# EAGLE design criticality_shield (EAGLE 7.0.0)
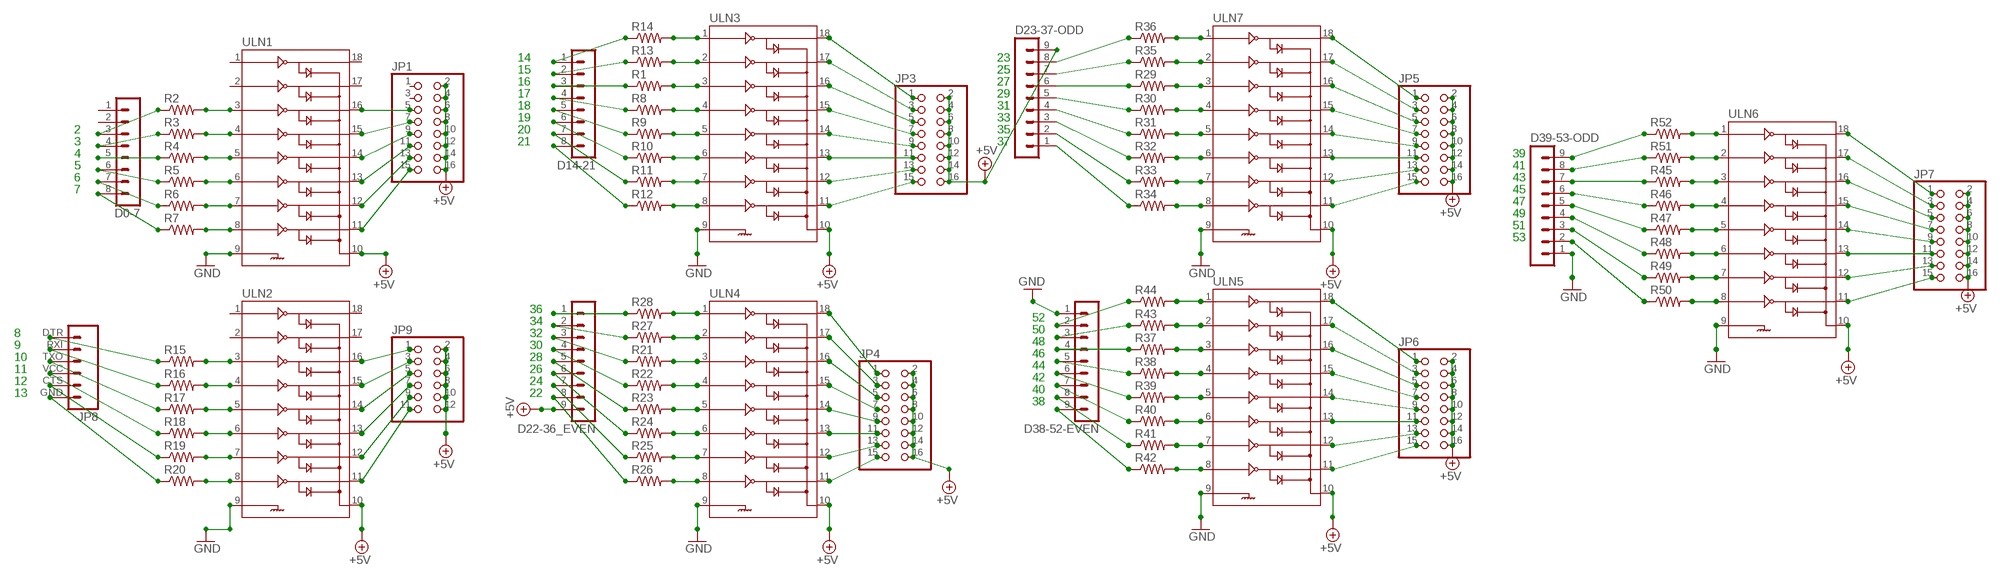
[diagram p0: schematic, sheet 1]

## Parts
D0-7  MA08-1  [MA08-1]
D14-21  MA08-1  [MA08-1]
D22-36_EVEN  MA09-1  [MA09-1]
D23-37-ODD  MA09-1  [MA09-1]
D38-52-EVEN  MA09-1  [MA09-1]
D39-53-ODD  MA09-1  [MA09-1]
JP1  PINHD-2X8  [2X08]
JP3  PINHD-2X8  [2X08]
JP4  PINHD-2X8  [2X08]
JP5  PINHD-2X8  [2X08]
JP6  PINHD-2X8  [2X08]
JP7  PINHD-2X8  [2X08]
JP8  M06SIP  [1X06]
JP9  PINHD-2X6  [2X06]
R1  RESISTOR0603  [0603-RES]
R2  RESISTOR0603  [0603-RES]
R3  RESISTOR0603  [0603-RES]
R4  RESISTOR0603  [0603-RES]
R5  RESISTOR0603  [0603-RES]
R6  RESISTOR0603  [0603-RES]
R7  RESISTOR0603  [0603-RES]
R8  RESISTOR0603  [0603-RES]
R9  RESISTOR0603  [0603-RES]
R10  RESISTOR0603  [0603-RES]
R11  RESISTOR0603  [0603-RES]
R12  RESISTOR0603  [0603-RES]
R13  RESISTOR0603  [0603-RES]
R14  RESISTOR0603  [0603-RES]
R15  RESISTOR0603  [0603-RES]
R16  RESISTOR0603  [0603-RES]
R17  RESISTOR0603  [0603-RES]
R18  RESISTOR0603  [0603-RES]
R19  RESISTOR0603  [0603-RES]
R20  RESISTOR0603  [0603-RES]
R21  RESISTOR0603  [0603-RES]
R22  RESISTOR0603  [0603-RES]
R23  RESISTOR0603  [0603-RES]
R24  RESISTOR0603  [0603-RES]
R25  RESISTOR0603  [0603-RES]
R26  RESISTOR0603  [0603-RES]
R27  RESISTOR0603  [0603-RES]
R28  RESISTOR0603  [0603-RES]
R29  RESISTOR0603  [0603-RES]
R30  RESISTOR0603  [0603-RES]
R31  RESISTOR0603  [0603-RES]
R32  RESISTOR0603  [0603-RES]
R33  RESISTOR0603  [0603-RES]
R34  RESISTOR0603  [0603-RES]
R35  RESISTOR0603  [0603-RES]
R36  RESISTOR0603  [0603-RES]
R37  RESISTOR0603  [0603-RES]
R38  RESISTOR0603  [0603-RES]
R39  RESISTOR0603  [0603-RES]
R40  RESISTOR0603  [0603-RES]
R41  RESISTOR0603  [0603-RES]
R42  RESISTOR0603  [0603-RES]
R43  RESISTOR0603  [0603-RES]
R44  RESISTOR0603  [0603-RES]
R45  RESISTOR0603  [0603-RES]
R46  RESISTOR0603  [0603-RES]
R47  RESISTOR0603  [0603-RES]
R48  RESISTOR0603  [0603-RES]
R49  RESISTOR0603  [0603-RES]
R50  RESISTOR0603  [0603-RES]
R51  RESISTOR0603  [0603-RES]
R52  RESISTOR0603  [0603-RES]
ULN1  ULN2803SOICW  [SO18L]
ULN2  ULN2803SOICW  [SO18L]
ULN3  ULN2803SOICW  [SO18L]
ULN4  ULN2803SOICW  [SO18L]
ULN5  ULN2803SOICW  [SO18L]
ULN6  ULN2803SOICW  [SO18L]
ULN7  ULN2803SOICW  [SO18L]

## Nets
+5V: D22-36_EVEN.9 D23-37-ODD.9 JP1.2 JP1.4 JP1.6 JP1.8 JP1.10 JP1.12 JP1.14 JP1.16 JP3.2 JP3.4 JP3.6 JP3.8 JP3.10 JP3.12 JP3.14 JP3.16 JP4.2 JP4.4 JP4.6 JP4.8 JP4.10 JP4.12 JP4.14 JP4.16 JP5.2 JP5.4 JP5.6 JP5.8 JP5.10 JP5.12 JP5.14 JP5.16 JP6.2 JP6.4 JP6.6 JP6.8 JP6.10 JP6.12 JP6.14 JP6.16 JP7.2 JP7.4 JP7.6 JP7.8 JP7.10 JP7.12 JP7.14 JP7.16 JP9.2 JP9.4 JP9.6 JP9.8 JP9.10 JP9.12 ULN1.10 ULN2.10 ULN3.10 ULN4.10 ULN5.10 ULN6.10 ULN7.10
GND: D38-52-EVEN.1 D39-53-ODD.1 ULN1.9 ULN2.9 ULN3.9 ULN4.9 ULN5.9 ULN6.9 ULN7.9
N$1: D0-7.3 R2.1
N$2: D0-7.4 R3.1
N$3: D0-7.5 R4.1
N$4: D0-7.6 R5.1
N$5: JP8.DTR R15.1
N$6: JP8.RXI R16.1
N$7: D0-7.7 R6.1
N$8: D0-7.8 R7.1
N$9: R13.2 ULN3.2
N$10: R14.2 ULN3.1
N$11: JP1.5 ULN1.16
N$12: JP1.7 ULN1.15
N$13: JP8.TXO R17.1
N$14: JP8.VCC R18.1
N$15: JP8.CTS R19.1
N$16: JP8.GND R20.1
N$18: JP9.1 ULN2.16
N$19: JP9.3 ULN2.15
N$20: D14-21.1 R14.1
N$21: D14-21.2 R13.1
N$22: D14-21.3 R1.1
N$23: D14-21.4 R8.1
N$24: JP9.5 ULN2.14
N$25: JP9.7 ULN2.13
N$26: JP9.9 ULN2.12
N$27: D14-21.5 R9.1
N$28: D14-21.6 R10.1
N$29: JP1.13 ULN1.12
N$30: JP1.15 ULN1.11
N$31: D14-21.7 R11.1
N$32: D14-21.8 R12.1
N$33: JP3.1 ULN3.18
N$34: JP3.3 ULN3.17
N$35: R26.2 ULN4.8
N$36: R25.2 ULN4.7
N$37: R12.2 ULN3.8
N$38: R11.2 ULN3.7
N$39: R24.2 ULN4.6
N$40: R23.2 ULN4.5
N$41: R22.2 ULN4.4
N$42: R21.2 ULN4.3
N$43: R10.2 ULN3.6
N$44: R9.2 ULN3.5
N$45: R27.2 ULN4.2
N$46: R28.2 ULN4.1
N$47: D22-36_EVEN.1 R28.1
N$48: D22-36_EVEN.2 R27.1
N$49: D22-36_EVEN.3 R21.1
N$50: D22-36_EVEN.4 R22.1
N$51: R34.2 ULN7.8
N$52: R33.2 ULN7.7
N$53: D22-36_EVEN.5 R23.1
N$54: D22-36_EVEN.6 R24.1
N$55: D22-36_EVEN.7 R25.1
N$56: D22-36_EVEN.8 R26.1
N$57: R32.2 ULN7.6
N$58: R31.2 ULN7.5
N$59: R30.2 ULN7.4
N$60: R29.2 ULN7.3
N$61: R35.2 ULN7.2
N$62: R36.2 ULN7.1
N$63: D23-37-ODD.8 R36.1
N$64: D23-37-ODD.7 R35.1
N$65: D23-37-ODD.6 R29.1
N$66: JP1.9 ULN1.14
N$67: JP1.11 ULN1.13
N$68: D23-37-ODD.5 R30.1
N$69: D23-37-ODD.4 R31.1
N$70: R42.2 ULN5.8
N$71: R41.2 ULN5.7
N$72: R40.2 ULN5.6
N$73: R39.2 ULN5.5
N$74: R38.2 ULN5.4
N$75: R37.2 ULN5.3
N$76: R43.2 ULN5.2
N$77: R44.2 ULN5.1
N$78: D38-52-EVEN.2 R44.1
N$79: D38-52-EVEN.3 R43.1
N$80: D38-52-EVEN.4 R37.1
N$81: D38-52-EVEN.5 R38.1
N$82: D23-37-ODD.3 R32.1
N$83: D23-37-ODD.2 R33.1
N$84: D23-37-ODD.1 R34.1
N$85: D38-52-EVEN.6 R39.1
N$86: D38-52-EVEN.7 R40.1
N$87: D38-52-EVEN.8 R41.1
N$88: D38-52-EVEN.9 R42.1
N$89: R50.2 ULN6.8
N$90: R49.2 ULN6.7
N$91: R48.2 ULN6.6
N$92: R47.2 ULN6.5
N$93: R46.2 ULN6.4
N$94: R45.2 ULN6.3
N$95: R51.2 ULN6.2
N$96: R52.2 ULN6.1
N$97: D39-53-ODD.9 R52.1
N$98: D39-53-ODD.8 R51.1
N$99: D39-53-ODD.7 R45.1
N$100: D39-53-ODD.6 R46.1
N$101: D39-53-ODD.5 R47.1
N$102: D39-53-ODD.4 R48.1
N$103: D39-53-ODD.3 R49.1
N$104: D39-53-ODD.2 R50.1
N$105: R7.2 ULN1.8
N$106: R6.2 ULN1.7
N$107: R5.2 ULN1.6
N$108: R4.2 ULN1.5
N$109: R3.2 ULN1.4
N$110: R2.2 ULN1.3
N$111: R8.2 ULN3.4
N$112: R1.2 ULN3.3
N$113: JP4.1 ULN4.18
N$114: JP4.3 ULN4.17
N$115: JP4.5 ULN4.16
N$116: JP4.7 ULN4.15
N$117: JP4.9 ULN4.14
N$118: JP4.11 ULN4.13
N$119: JP4.13 ULN4.12
N$120: JP4.15 ULN4.11
N$121: JP9.11 ULN2.11
N$122: JP5.1 ULN7.18
N$123: JP5.3 ULN7.17
N$124: JP5.5 ULN7.16
N$125: JP5.7 ULN7.15
N$126: JP5.9 ULN7.14
N$127: JP3.5 ULN3.16
N$128: JP3.7 ULN3.15
N$129: JP3.9 ULN3.14
N$130: JP3.11 ULN3.13
N$131: JP3.13 ULN3.12
N$132: JP3.15 ULN3.11
N$133: R20.2 ULN2.8
N$134: R19.2 ULN2.7
N$135: JP7.1 ULN6.18
N$136: JP7.3 ULN6.17
N$137: JP7.5 ULN6.16
N$138: JP7.7 ULN6.15
N$139: JP7.9 ULN6.14
N$140: JP7.11 ULN6.13
N$141: JP7.13 ULN6.12
N$142: JP7.15 ULN6.11
N$143: JP5.11 ULN7.13
N$144: JP5.13 ULN7.12
N$145: JP5.15 ULN7.11
N$146: JP6.1 ULN5.18
N$147: JP6.3 ULN5.17
N$148: JP6.5 ULN5.16
N$149: JP6.7 ULN5.15
N$150: JP6.9 ULN5.14
N$159: R18.2 ULN2.6
N$160: R17.2 ULN2.5
N$161: R16.2 ULN2.4
N$162: R15.2 ULN2.3
N$163: JP6.11 ULN5.13
N$164: JP6.13 ULN5.12
N$165: JP6.15 ULN5.11
Unconnected: D0-7.1 D0-7.2 JP1.1 JP1.3 ULN1.1 ULN1.2 ULN1.17 ULN1.18 ULN2.1 ULN2.2 ULN2.17 ULN2.18

## Notes on the sheet
- 14 | 23
- 15 | 25
- 16 | 27
- 17 | 29
- 18 | 31
- 19 | 33
- 2 | 20 | 35
- 3 | 21 | 37
- 4 | 39
- 5 | 41
- 6 | 43
- 7 | 45
- 47
- 49
- 51
- 53
- 36 | 52
- 34 | 50
- 8 | 32 | 48
- 9 | 30 | 46
- 10 | 28 | 44
- 11 | 26 | 42
- 12 | 24 | 40
- 13 | 22 | 38

## Library data of the parts
D0-7 D14-21 = con-lstb:MA08-1: PIN HEADER; OC_FARNELL: unknown; OC_NEWARK: unknown
D22-36_EVEN D23-37-ODD D38-52-EVEN D39-53-ODD = con-lstb:MA09-1: PIN HEADER; OC_FARNELL: unknown; OC_NEWARK: unknown
JP1 JP3-JP7 = pinhead:PINHD-2X8: PIN HEADER
JP8 = SparkFun-Connectors:M06: Header 6 Standard 6-pin 0.1" header. Use with straight break away headers (SKU : PRT-00116), right angle break away headers (PRT-00553), swiss pins (PRT-00743), machine pins (PRT-00117), and female headers (PRT-00115). Molex polarized connector foot print use with SKU : PRT-08094 with associated crimp pins and housings. NOTES ON THE VARIANTS LOCK and LOCK_LONGPADS... This footprint was designed to help hold the alignment of a through-hole component (i.e. 6-pin header) while soldering it into place. You may notice that each hole has been shifted either up or down by 0.005 of an inch from it's more standard position (which is a perfectly straight line). This slight alteration caused the pins (the squares in the middle) to touch the edges of the holes. Because they are alternating, it causes a "brace" to hold the component in place. 0.005 has proven to be the perfect amount of "off-center" position when using our standard breakaway headers. Although looks a little odd when you look at the bare footprint, once you have a header in there, the alteration is very hard to notice. Also,if you push a header all the way into place, it is covered up entirely on the bottom side. This idea of altering the position of holes to aid alignment will be further integrated into the Sparkfun Library for other footprints. It can help hold any component with 3 or more connection pins.
JP9 = pinhead:PINHD-2X6: PIN HEADER
R1-R52 = SparkFun-Resistors:RESISTOR: Resistor Basic schematic elements and footprints for 0603, 1206, and PTH resistors.
ULN1-ULN7 = SparkFun-PowerIC:ULN2803: Darlington Driver ULN2803 Darlington array. 500mA max per channel, 8-channel package. Spark Fun Electronics SKU : COM-00312

## Board
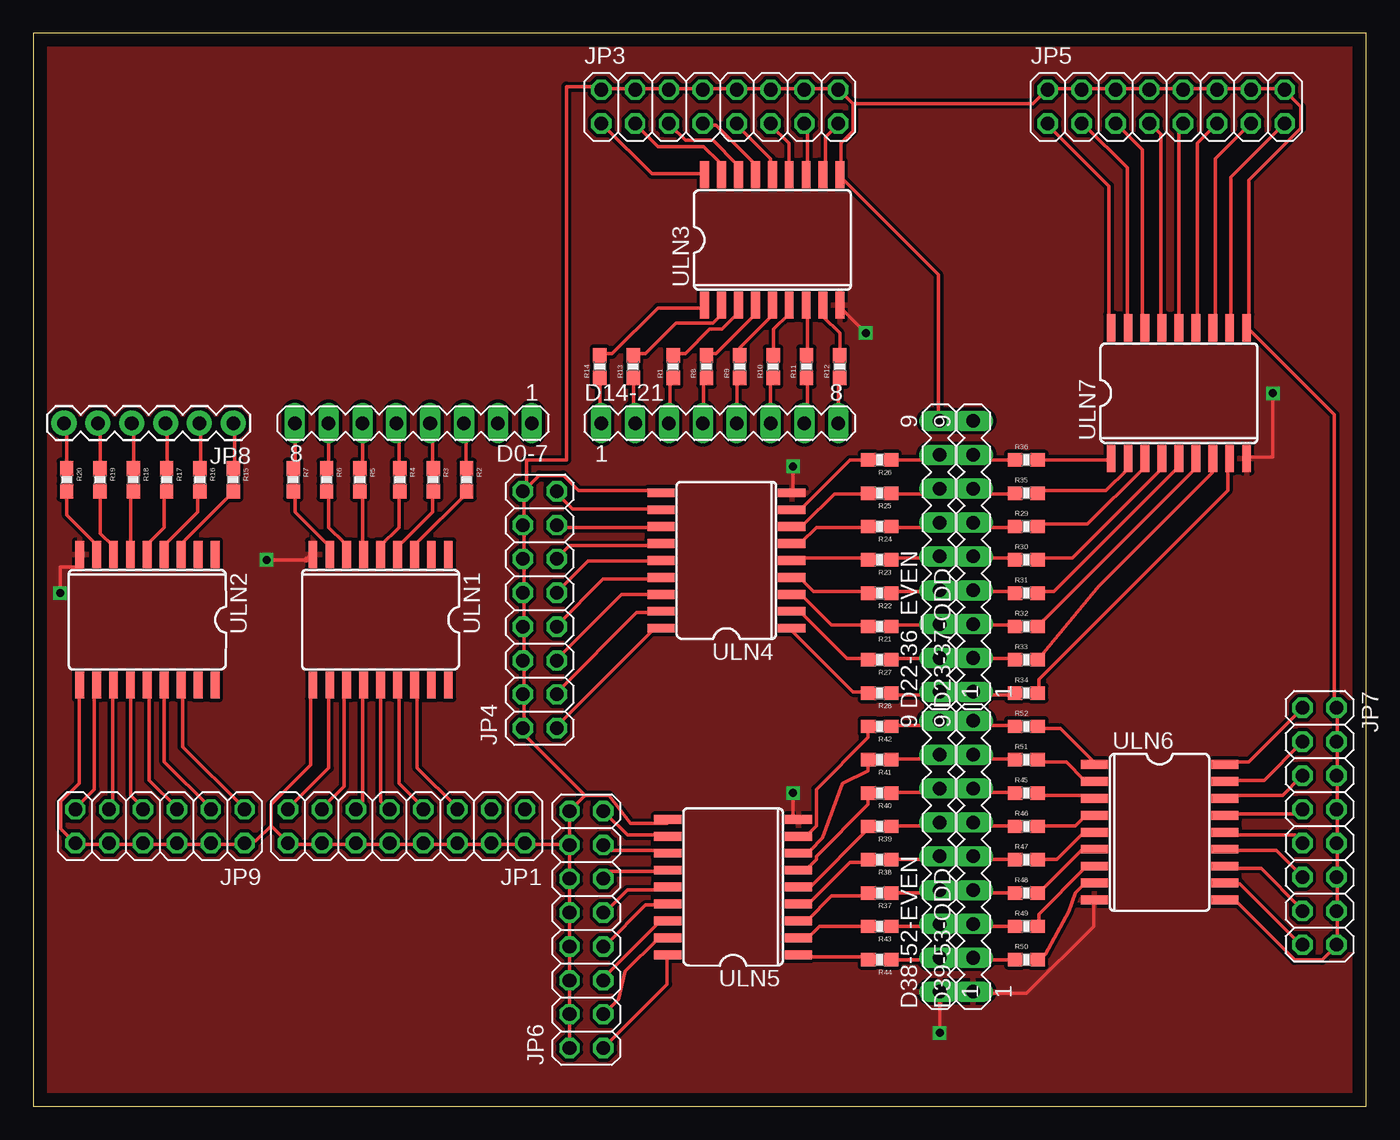
[diagram p1: board, top side]
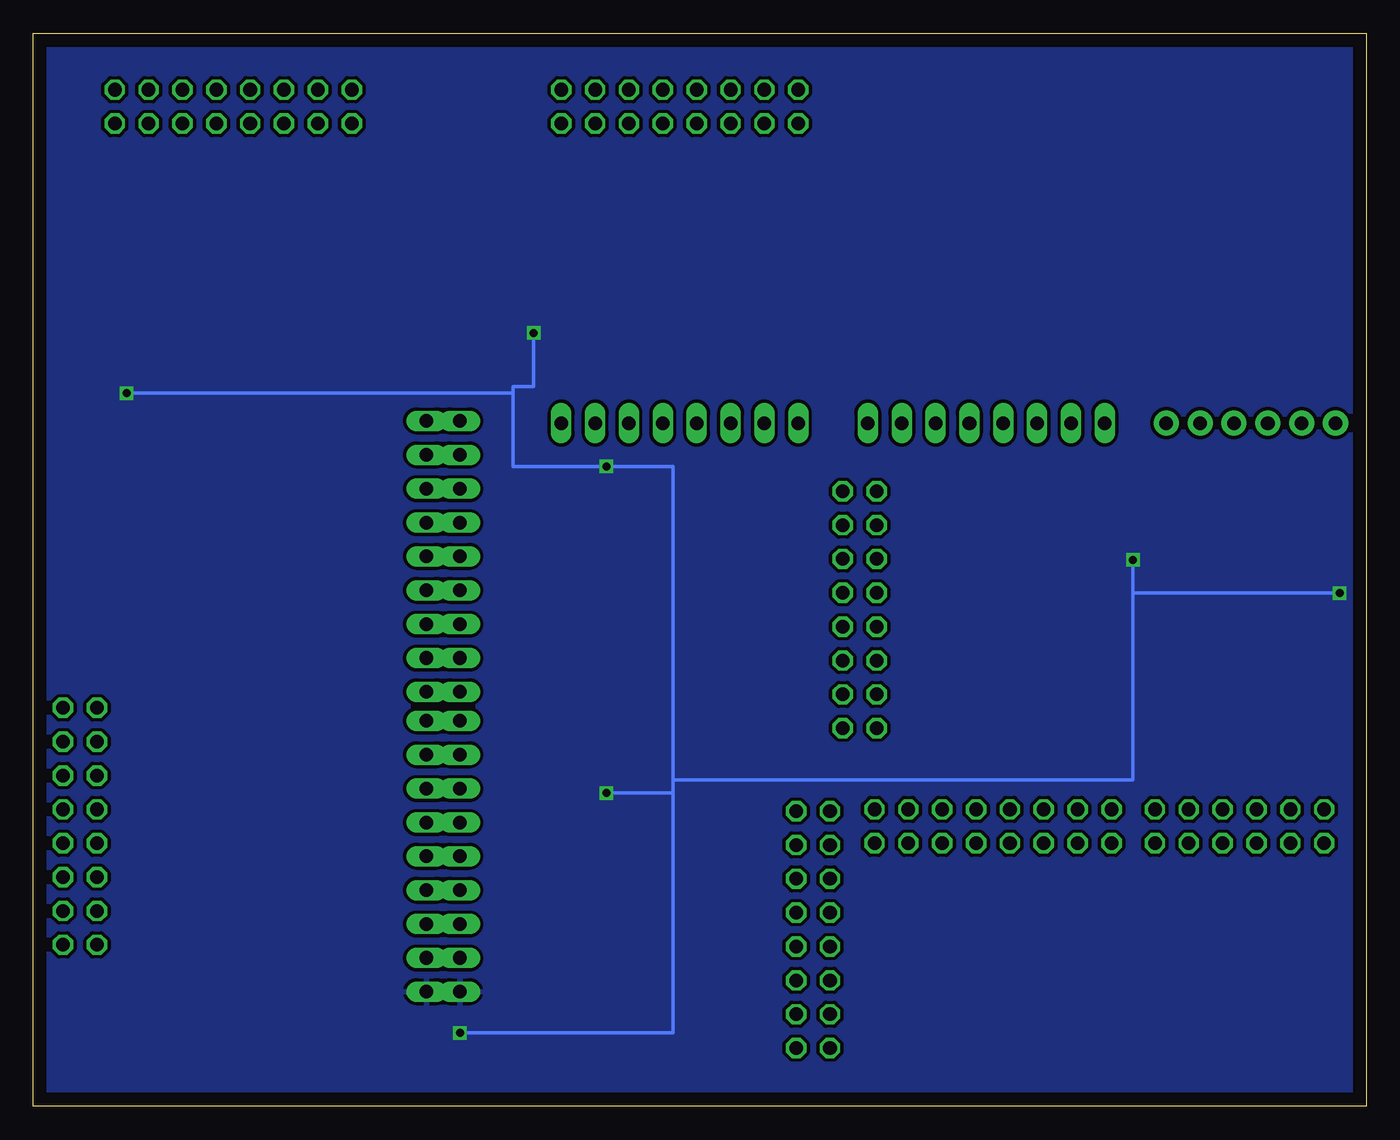
[diagram p2: board, bottom side, seen from below]

Size 100 x 80.5 mm. Coordinates in mm from the lower left corner, seen from the top.
Outline: 0,0 100,0 100,80.5 0,80.5 0,0
Copper layers (1*16): Top 0.035mm / dielectric 1.5mm / Bottom 0.035mm
Design rules "default": minimum track width 10mil, minimum drill 24mil, track to track 8mil, track to pad 8mil, pad to pad 8mil, via to via 8mil, smd to smd 8mil, copper to edge 40mil, drill to drill 8mil, minimum pad ring 10mil, minimum via ring 8mil, stop-mask expansion 4mil, vias tented up to drill 0mil, thermal gap 10mil

### Footprints (pad centres in the part's own frame; a part is rotated, then mirrored left to right if it is on the bottom)
MA08-1 = drill 1.016 long: 1 -8.89,0; 2 -6.35,0; 3 -3.81,0; 4 -1.27,0; 5 1.27,0; 6 3.81,0; 7 6.35,0; 8 8.89,0
MA09-1 = drill 1.016 long: 1 -10.16,0; 2 -7.62,0; 3 -5.08,0; 4 -2.54,0; 5 0,0; 6 2.54,0; 7 5.08,0; 8 7.62,0; 9 10.16,0
2X08 = drill 1.016 octagon: 1 -8.89,-1.27; 2 -8.89,1.27; 3 -6.35,-1.27; 4 -6.35,1.27; 5 -3.81,-1.27; 6 -3.81,1.27; 7 -1.27,-1.27; 8 -1.27,1.27; 9 1.27,-1.27; 10 1.27,1.27; 11 3.81,-1.27; 12 3.81,1.27; 13 6.35,-1.27; 14 6.35,1.27; 15 8.89,-1.27; 16 8.89,1.27
1X06 = drill 1.016 pad 1.88: CTS 10.16,0; DTR 0,0; GND 12.7,0; RXI 2.54,0; TXO 5.08,0; VCC 7.62,0
2X06 = drill 1.016 octagon: 1 -6.35,-1.27; 2 -6.35,1.27; 3 -3.81,-1.27; 4 -3.81,1.27; 5 -1.27,-1.27; 6 -1.27,1.27; 7 1.27,-1.27; 8 1.27,1.27; 9 3.81,-1.27; 10 3.81,1.27; 11 6.35,-1.27; 12 6.35,1.27
0603-RES = smd 1.1 x 1: 1 -0.85,0; 2 0.85,0
SO18L = smd 0.66 x 2.032: 1 -0.635,-4.902; 2 0.635,-4.902; 3 1.905,-4.902; 4 3.175,-4.902; 5 4.445,-4.902; 6 5.715,-4.902; 7 6.985,-4.902; 8 8.255,-4.902; 9 9.525,-4.902; 10 9.525,4.902; 11 8.255,4.902; 12 6.985,4.902; 13 5.715,4.902; 14 4.445,4.902; 15 3.175,4.902; 16 1.905,4.902; 17 0.635,4.902; 18 -0.635,4.902

### Placement (x,y rotation side)
D0-7  28.5,51.25 180 top
D14-21  51.5,51.25 0 top
D22-36_EVEN  68,41.25 90 top
D23-37-ODD  70.5,41.25 90 top
D38-52-EVEN  68,18.75 90 top
D39-53-ODD  70.5,18.75 90 top
JP1  28,21 180 top
JP3  51.5,75 0 top
JP4  38,37.25 90 top
JP5  85,75 0 top
JP6  41.5,13.25 90 top
JP7  96.5,21 270 top
JP8  15,51.25 180 top
JP9  9.5,21 180 top
R1  48,55.5 90 top
R2  32.5,47 270 top
R3  30,47 270 top
R4  27.5,47 270 top
R5  24.5,47 270 top
R6  22,47 270 top
R7  19.5,47 270 top
R8  50.5,55.5 90 top
R9  53,55.5 90 top
R10  55.5,55.5 90 top
R11  58,55.5 90 top
R12  60.5,55.5 90 top
R13  45,55.5 90 top
R14  42.5,55.5 90 top
R15  15,47 270 top
R16  12.5,47 270 top
R17  10,47 270 top
R18  7.5,47 270 top
R19  5,47 270 top
R20  2.5,47 270 top
R21  63.5,36 180 top
R22  63.5,38.5 180 top
R23  63.5,41 180 top
R24  63.5,43.5 180 top
R25  63.5,46 180 top
R26  63.5,48.5 180 top
R27  63.5,33.5 180 top
R28  63.5,31 180 top
R29  74.5,43.5 0 top
R30  74.5,41 0 top
R31  74.5,38.5 0 top
R32  74.5,36 0 top
R33  74.5,33.5 0 top
R34  74.5,31 0 top
R35  74.5,46 0 top
R36  74.5,48.5 0 top
R37  63.5,16 180 top
R38  63.5,18.5 180 top
R39  63.5,21 180 top
R40  63.5,23.5 180 top
R41  63.5,26 180 top
R42  63.5,28.5 180 top
R43  63.5,13.5 180 top
R44  63.5,11 180 top
R45  74.5,23.5 0 top
R46  74.5,21 0 top
R47  74.5,18.5 0 top
R48  74.5,16 0 top
R49  74.5,13.5 0 top
R50  74.5,11 0 top
R51  74.5,26 0 top
R52  74.5,28.5 0 top
ULN1  30.5,36.5 180 top
ULN2  13,36.5 180 top
ULN3  51,65 0 top
ULN4  52,36.5 90 top
ULN5  52.5,12 90 top
ULN6  84.5,25 270 top
ULN7  81.5,53.5 0 top

### Tracks (layer width: path | path; a pad name or v marks a point on that pad's centre or on a via)
+5V
  Top 0.254: 36.8,46.18 37.95,47.32 39.78,47.32 40.92,46.18 47.09,46.18 ULN4.10 | 36.8,46.18 JP4.16 36.8,45.95 36.8,43.66 JP4.14 36.8,43.43 36.8,41.15 JP4.12 36.8,40.92 36.8,38.63 JP4.10 36.8,38.41 36.8,36.12 JP4.8 36.8,35.89 36.8,33.6 JP4.6 36.8,33.38 36.8,31.09 JP4.4 36.8,30.86 36.8,28.57 JP4.2 36.8,28.35 36.8,27.89 41.38,23.32 | 41.38,23.32 43.2,23.32 44.81,21.22 47.55,21.22 ULN5.10 | 41.38,23.32 40.23,22.17 JP6.16 40.23,21.95 40.23,19.66 JP6.14 | JP6.2 40.23,4.57 40.23,6.86 JP6.4 40.23,7.09 40.23,9.37 JP6.6 40.23,9.6 40.23,11.89 JP6.8 40.23,12.12 40.23,14.4 JP6.10 40.23,14.63 40.23,16.92 JP6.12 40.23,17.14 40.23,19.43 JP6.14 | ULN2.10 3.43,31.55 3.43,24.23 2.06,22.86 2.06,20.8 2.97,19.89 JP9.12 3.2,19.66 5.49,19.66 JP9.10 5.71,19.66 8.23,19.66 JP9.8 8.46,19.66 10.74,19.66 JP9.6 10.97,19.66 13.26,19.66 JP9.4 13.49,19.66 15.77,19.66 JP9.2 16,19.89 16.69,19.89 17.83,21.03 | 17.83,21.03 17.83,22.63 20.8,25.6 20.8,31.55 ULN1.10 | 17.83,21.03 18.97,19.89 JP1.16 19.2,19.66 21.49,19.66 JP1.14 21.72,19.66 24,19.66 JP1.12 24.23,19.66 26.52,19.66 JP1.10 26.75,19.66 29.26,19.66 JP1.8 29.49,19.66 31.77,19.66 JP1.6 32,19.66 34.29,19.66 JP1.4 34.52,19.66 36.8,19.66 JP1.2 37.03,19.66 40.01,19.66 JP6.14 | D23-37-ODD.9 70.41,51.21 68.12,51.21 D22-36_EVEN.9 67.89,51.21 67.89,62.41 60.58,69.72 ULN3.10 60.58,69.95 60.58,72.24 61.49,73.15 61.49,75.21 | 61.49,75.21 60.58,76.12 JP3.16 60.35,76.35 58.06,76.35 JP3.14 57.84,76.35 55.32,76.35 JP3.12 55.09,76.35 52.81,76.35 JP3.10 52.58,76.35 50.29,76.35 JP3.8 50.06,76.35 47.78,76.35 JP3.6 47.55,76.35 45.26,76.35 JP3.4 45.03,76.35 42.75,76.35 JP3.2 42.61,76.5 40,76.5 40,48.5 37,48.5 37,46.18 36.8,46.18
  Top 0.254: ULN6.10 89.61,15.32 90.3,15.32 94.64,10.97 96.7,10.97 97.61,11.89 JP7.16 97.84,12.12 97.84,14.63 JP7.14 97.84,14.86 97.84,17.14 JP7.12 97.84,17.37 97.84,19.66 JP7.10 97.84,19.89 97.84,22.17 JP7.8 97.84,22.4 97.84,24.69 JP7.6 97.84,24.92 97.84,27.2 JP7.4 97.84,27.43 97.84,29.72 JP7.2 97.61,29.95 97.61,51.89 91.21,58.29 ULN7.10 91.21,58.52 91.21,69.49 95.1,73.38 95.1,74.98 93.95,76.12 JP5.16 93.73,76.35 91.44,76.35 JP5.14 91.21,76.35 88.92,76.35 JP5.12 88.7,76.35 86.41,76.35 JP5.10 86.18,76.35 83.9,76.35 JP5.8 83.67,76.35 81.38,76.35 JP5.6 81.15,76.35 78.87,76.35 JP5.4 78.64,76.35 76.12,76.35 JP5.2 75.89,76.12 74.98,75.21 61.49,75.21
  Bottom 0.254: 36.8,46.18 JP4.16
GND  (via drill 0.6)
  Top 0.254: ULN6.9 79.55,15.32 79.55,13.49 74.52,8.46 70.64,8.46 D39-53-ODD.1 70.41,8.46 68.12,8.46 D38-52-EVEN.1 | 20.57,41.15 20.8,41.38 ULN1.9 | 20.57,41.15 20.46,41.04 | ULN2.9 3.66,41.38 3.66,40.46 2,40.46 v2,38.5 | 57.84,46.18 56.92,46.18 ULN4.9 | v62.45,58.02 60.58,59.89 ULN3.9 | 90.98,49.38 90.98,48.69 | 90.98,48.69 ULN7.9 | 20.86,40.86 20.57,41.15 | v17.5,41 20.86,41 | 57,46.02 v57,48 | 57,21.52 v57,23.5 | 68,8.5 v68,5.5 | 90.98,48.69 93,48.69 v93,53.5
  Top 0.406: 20.46,41 20.46,41.04 | 20.86,41 20.86,40.86 | ULN4.9 57,46.02 | ULN5.9 57,21.52 | 68.12,8.46 68,8.46
  Bottom 0.254: 17.5,38.5 v17.5,41 | 52,24.5 52,48 v57,48 64,48 64,53.5 | 52,24.5 52,23.5 | v57,23.5 52,23.5 | v68,5.5 52,5.5 52,23.5 | v2,38.5 17.5,38.5 | v62.45,58.02 62.45,54 64,54 64,53.5 | v93,53.5 64,53.5 | 52,24.5 17.5,24.5 17.5,38.5
  pour Bottom (isolate 0.254): 0,80.5 0,0 100,0 100,1.5 100,80.5
  pour Top (isolate 0.254): 0,80.5 0,-0.5 100,-0.5 100,3.5 100,81 0,81
N$1
  Top 0.254: R2.1 32.46,48.01 32.46,51.21 D0-7.3
N$2
  Top 0.254: R3.1 29.95,48.01 29.95,51.21 D0-7.4
N$3
  Top 0.254: R4.1 27.43,48.01 27.43,51.21 D0-7.5
N$4
  Top 0.254: R5.1 24.69,48.01 24.69,51.21 D0-7.6
N$5
  Top 0.254: R15.1 15.09,48.01 15.09,51.21 JP8.DTR
N$6
  Top 0.254: R16.1 12.57,48.01 12.57,51.21 JP8.RXI
N$7
  Top 0.254: R6.1 22.17,48.01 22.17,51.21 D0-7.7
N$8
  Top 0.254: R7.1 19.66,48.01 19.66,51.21 D0-7.8
N$9
  Top 0.254: R13.2 45.03,56.46 45.95,56.46 48.23,58.75 50.98,58.75 51.44,59.21 51.44,59.89 ULN3.2
N$10
  Top 0.254: R14.2 42.52,56.46 43.43,56.46 46.86,59.89 50.29,59.89 ULN3.1
N$11
  Top 0.254: ULN1.16 28.8,31.55 28.8,25.38 31.77,22.4 JP1.5
N$12
  Top 0.254: ULN1.15 27.43,31.55 27.43,24.23 29.26,22.4 JP1.7
N$13
  Top 0.254: R17.1 10.06,48.01 10.06,51.21 JP8.TXO
N$14
  Top 0.254: R18.1 7.54,48.01 7.54,51.21 JP8.VCC
N$15
  Top 0.254: R19.1 5.03,48.01 5.03,51.21 JP8.CTS
N$16
  Top 0.254: R20.1 2.52,48.01 2.52,51.21 JP8.GND
N$18
  Top 0.254: ULN2.16 11.2,31.55 11.2,26.98 15.77,22.4 JP9.1
N$19
  Top 0.254: ULN2.15 9.83,31.55 9.83,25.83 13.26,22.4 JP9.3
N$20
  Top 0.254: R14.1 42.52,54.63 42.52,51.44 D14-21.1
N$21
  Top 0.254: R13.1 45.03,54.63 45.03,51.44 D14-21.2
N$22
  Top 0.254: R1.1 47.78,54.63 47.78,51.44 D14-21.3
N$23
  Top 0.254: R8.1 50.29,54.63 50.29,51.44 D14-21.4
N$24
  Top 0.254: ULN2.14 8.69,31.55 8.69,24.46 10.74,22.4 JP9.5
N$25
  Top 0.254: ULN2.13 7.32,31.55 7.32,23.32 8.23,22.4 JP9.7
N$26
  Top 0.254: ULN2.12 5.94,31.55 5.94,22.63 5.71,22.4 JP9.9
N$27
  Top 0.254: R9.1 52.81,54.63 52.81,51.44 D14-21.5
N$28
  Top 0.254: R10.1 55.32,54.63 55.32,51.44 D14-21.6
N$29
  Top 0.254: ULN1.12 23.32,31.55 23.32,24 21.72,22.4 JP1.13
N$30
  Top 0.254: ULN1.11 22.17,31.55 22.17,25.38 19.2,22.4 JP1.15
N$31
  Top 0.254: R11.1 58.06,54.63 58.06,51.44 D14-21.7
N$32
  Top 0.254: R12.1 60.39,54.65 D14-21.8
N$33
  Top 0.254: ULN3.18 50.29,69.95 46.41,69.95 42.75,73.61 JP3.1
N$34
  Top 0.254: ULN3.17 51.44,69.95 51.44,70.87 50.29,72.01 46.86,72.01 45.26,73.61 JP3.3
N$35
  Top 0.254: R26.2 62.64,48.46 61.27,48.46 57.61,44.81 56.92,44.81 ULN4.8
N$36
  Top 0.254: R25.2 62.64,45.95 60.12,45.95 57.84,43.66 56.92,43.66 ULN4.7
N$37
  Top 0.254: R12.2 60.5,58 59.26,59.24 ULN3.8
N$38
  Top 0.254: R11.2 58.06,56.46 58.06,59.89 ULN3.7
N$39
  Top 0.254: R24.2 62.64,43.43 58.75,43.43 57.61,42.29 56.92,42.29 ULN4.6
N$40
  Top 0.254: R23.2 62.64,41.15 56.92,41.15 ULN4.5
N$41
  Top 0.254: R22.2 62.64,38.63 58.52,38.63 57.61,39.55 56.92,39.55 ULN4.4
N$42
  Top 0.254: R21.2 62.64,36.12 59.89,36.12 57.61,38.41 56.92,38.41 ULN4.3
N$43
  Top 0.254: R10.2 55.55,56.46 55.55,58.29 56.69,59.44 56.69,59.89 ULN3.6
N$44
  Top 0.254: R9.2 53.03,56.46 53.03,56.92 55.32,59.21 55.32,59.89 ULN3.5
N$45
  Top 0.254: R27.2 62.64,33.6 61.04,33.6 57.61,37.03 56.92,37.03 ULN4.2
N$46
  Top 0.254: R28.2 62.64,31.09 61.49,31.09 56.92,35.66 ULN4.1
N$47
  Top 0.254: R28.1 64.47,30.86 67.89,30.86 D22-36_EVEN.1
N$48
  Top 0.254: R27.1 64.47,33.6 67.89,33.6 D22-36_EVEN.2
N$49
  Top 0.254: R21.1 64.47,36.12 67.89,36.12 D22-36_EVEN.3
N$50
  Top 0.254: R22.1 64.47,38.63 67.89,38.63 D22-36_EVEN.4
N$51
  Top 0.254: R34.2 75.44,31.09 75.44,32 89.61,46.18 89.61,48.46 ULN7.8
N$52
  Top 0.254: R33.2 75.44,33.6 79.94,39.02 88.47,47.55 88.47,48.46 ULN7.7
N$53
  Top 0.254: R23.1 64.47,41.15 67.89,41.15 D22-36_EVEN.5
N$54
  Top 0.254: R24.1 64.47,43.43 67.89,43.43 D22-36_EVEN.6
N$55
  Top 0.254: R25.1 64.47,45.95 67.89,45.95 D22-36_EVEN.7
N$56
  Top 0.254: R26.1 64.47,48.46 67.89,48.46 D22-36_EVEN.8
N$57
  Top 0.254: R32.2 75.44,36.12 87.1,47.78 87.1,48.46 ULN7.6
N$58
  Top 0.254: R31.2 75.44,38.63 76.58,38.63 85.72,47.78 85.72,48.46 ULN7.5
N$59
  Top 0.254: R30.2 75.44,41.15 77.95,41.15 84.58,47.78 84.58,48.46 ULN7.4
N$60
  Top 0.254: R29.2 75.44,43.66 79.1,43.66 83.21,47.78 83.21,48.46 ULN7.3
N$61
  Top 0.254: R35.2 75.44,46.18 80.47,46.18 82.07,47.78 82.07,48.46 ULN7.2
N$62
  Top 0.254: R36.2 75.44,48.46 80.7,48.46 ULN7.1
N$63
  Top 0.254: R36.1 73.61,48.46 70.64,48.46 D23-37-ODD.8
N$64
  Top 0.254: R35.1 73.61,45.95 70.64,45.95 D23-37-ODD.7
N$65
  Top 0.254: R29.1 73.61,43.43 70.64,43.43 D23-37-ODD.6
N$66
  Top 0.254: ULN1.14 26.06,31.55 26.06,22.86 26.52,22.4 JP1.9
N$67
  Top 0.254: ULN1.13 24.69,31.55 24.69,22.86 24.23,22.4 JP1.11
N$68
  Top 0.254: R30.1 73.61,41.15 70.64,41.15 D23-37-ODD.5
N$69
  Top 0.254: R31.1 73.61,38.63 70.64,38.63 D23-37-ODD.4
N$70
  Top 0.254: R42.2 62.64,28.35 62.64,27.66 58.75,23.77 58.75,21.03 58.06,20.34 57.61,20.34 ULN5.8
N$71
  Top 0.254: R41.2 62.64,25.83 62.64,25.15 60.71,24.22 59.21,20.12 58.29,19.2 57.61,19.2 ULN5.7
N$72
  Top 0.254: R40.2 62.64,23.32 62.64,22.63 58.75,18.75 58.75,18.52 58.06,17.83 57.61,17.83 ULN5.6
N$73
  Top 0.254: R39.2 62.64,20.8 58.29,16.46 57.61,16.46 ULN5.5
N$74
  Top 0.254: R38.2 62.64,18.29 61.27,18.29 58.29,15.32 57.61,15.32 ULN5.4
N$75
  Top 0.254: R37.2 62.64,15.77 59.89,15.77 58.06,13.95 57.61,13.95 ULN5.3
N$76
  Top 0.254: R43.2 62.64,13.49 58.98,13.49 58.29,12.8 57.61,12.8 ULN5.2
N$77
  Top 0.254: R44.2 62.64,11.2 57.61,11.2 ULN5.1
N$78
  Top 0.254: R44.1 64.47,10.97 67.89,10.97 D38-52-EVEN.2
N$79
  Top 0.254: R43.1 64.47,13.49 67.89,13.49 D38-52-EVEN.3
N$80
  Top 0.254: R37.1 64.47,16 67.89,16 D38-52-EVEN.4
N$81
  Top 0.254: R38.1 64.47,18.52 67.89,18.52 D38-52-EVEN.5
N$82
  Top 0.254: R32.1 73.61,36.12 70.64,36.12 D23-37-ODD.3
N$83
  Top 0.254: R33.1 73.61,33.6 70.64,33.6 D23-37-ODD.2
N$84
  Top 0.254: R34.1 73.61,30.86 70.64,30.86 D23-37-ODD.1
N$85
  Top 0.254: R39.1 64.47,21.03 67.89,21.03 D38-52-EVEN.6
N$86
  Top 0.254: R40.1 64.47,23.55 67.89,23.55 D38-52-EVEN.7
N$87
  Top 0.254: R41.1 64.47,26.06 67.89,26.06 D38-52-EVEN.8
N$88
  Top 0.254: R42.1 64.47,28.57 67.89,28.57 D38-52-EVEN.9
N$89
  Top 0.254: R50.2 75.44,11.2 75.94,11.39 77.68,14.63 78.18,16 78.87,16.69 79.55,16.69 ULN6.8
N$90
  Top 0.254: R49.2 75.44,13.72 75.44,14.4 78.87,17.83 79.55,17.83 ULN6.7
N$91
  Top 0.254: R48.2 75.44,16 78.64,19.2 79.55,19.2 ULN6.6
N$92
  Top 0.254: R47.2 75.44,18.52 76.81,18.52 78.64,20.34 79.55,20.34 ULN6.5
N$93
  Top 0.254: R46.2 75.44,21.03 78.18,21.03 78.87,21.72 79.55,21.72 ULN6.4
N$94
  Top 0.254: R45.2 75.44,23.32 79.55,23.32 ULN6.3
N$95
  Top 0.254: R51.2 75.44,25.83 77.5,25.83 78.87,24.46 79.55,24.46 ULN6.2
N$96
  Top 0.254: R52.2 75.44,28.35 77.04,28.35 79.55,25.83 ULN6.1
N$97
  Top 0.254: R52.1 73.61,28.57 70.64,28.57 D39-53-ODD.9
N$98
  Top 0.254: R51.1 73.61,26.06 70.64,26.06 D39-53-ODD.8
N$99
  Top 0.254: R45.1 73.61,23.55 70.64,23.55 D39-53-ODD.7
N$100
  Top 0.254: R46.1 73.61,21.03 70.64,21.03 D39-53-ODD.6
N$101
  Top 0.254: R47.1 73.61,18.52 70.64,18.52 D39-53-ODD.5
N$102
  Top 0.254: R48.1 73.61,16 70.64,16 D39-53-ODD.4
N$103
  Top 0.254: R49.1 73.61,13.49 70.64,13.49 D39-53-ODD.3
N$104
  Top 0.254: R50.1 73.61,10.97 70.64,10.97 D39-53-ODD.2
N$105
  Top 0.254: R7.2 19.66,45.95 19.66,44.58 22.17,42.06 22.17,41.6 ULN1.8
N$106
  Top 0.254: R6.2 22.17,45.95 22.17,43.43 23.32,42.29 23.32,41.6 ULN1.7
N$107
  Top 0.254: R5.2 24.69,45.95 24.69,41.6 ULN1.6
N$108
  Top 0.254: R4.2 27.43,45.95 27.43,43.43 26.06,42.06 26.06,41.6 ULN1.5
N$109
  Top 0.254: R3.2 29.95,45.95 29.95,44.58 27.43,42.06 27.43,41.6 ULN1.4
N$110
  Top 0.254: R2.2 32.46,45.95 28.8,42.29 28.8,41.6 ULN1.3
N$111
  Top 0.254: 53.95,59.21 53.95,59.89 ULN3.4 53.95,59.21 | 53.95,59.21 51.21,56.46 50.52,56.46 R8.2
N$112
  Top 0.254: R1.2 48.01,56.46 48.92,56.46 50.75,58.29 51.66,58.29 52.81,59.44 52.81,59.89 ULN3.3
N$113
  Top 0.254: ULN4.18 47.09,35.66 46.41,35.66 39.32,28.57 JP4.1
N$114
  Top 0.254: ULN4.17 47.09,37.03 45.26,37.03 39.32,31.09 JP4.3
N$115
  Top 0.254: ULN4.16 44.12,38.41 39.32,33.6 JP4.5
N$116
  Top 0.254: ULN4.15 47.09,39.55 42.75,39.55 39.32,36.12 JP4.7
N$117
  Top 0.254: ULN4.14 47.09,40.92 41.6,40.92 39.32,38.63 JP4.9
N$118
  Top 0.254: ULN4.13 47.09,42.06 40.23,42.06 39.32,41.15 JP4.11
N$119
  Top 0.254: ULN4.12 47.09,43.43 39.32,43.43 JP4.13
N$120
  Top 0.254: ULN4.11 47.09,44.81 40.46,44.81 39.32,45.95 JP4.15
N$121
  Top 0.254: ULN2.11 4.57,31.55 4.57,23.77 3.2,22.4 JP9.11
N$122
  Top 0.254: ULN7.18 80.7,58.52 80.7,69.04 76.12,73.61 JP5.1
N$123
  Top 0.254: ULN7.17 82.07,58.52 82.07,70.41 78.87,73.61 JP5.3
N$124
  Top 0.254: ULN7.16 83.21,58.52 83.21,71.78 81.38,73.61 JP5.5
N$125
  Top 0.254: 84.5,59 ULN7.15 84.58,58.98 84.58,72.92 83.9,73.61 JP5.7
N$126
  Top 0.254: ULN7.14 85.95,58.52 85.95,73.38 86.18,73.61 JP5.9
N$127
  Top 0.254: ULN3.16 52.81,69.95 52.81,70.64 50.98,72.47 48.92,72.47 47.78,73.61 JP3.5
N$128
  Top 0.254: ULN3.15 53.95,69.95 53.95,70.87 51.21,73.61 50.29,73.61 JP3.7
N$129
  Top 0.254: ULN3.14 55.32,69.95 55.32,71.09 52.81,73.61 JP3.9
N$130
  Top 0.254: ULN3.13 56.69,69.95 56.69,72.24 55.32,73.61 JP3.11
N$131
  Top 0.254: ULN3.12 58.06,69.95 58.06,73.61 JP3.13
N$132
  Top 0.254: ULN3.11 59.44,69.95 59.44,72.69 60.35,73.61 JP3.15
N$133
  Top 0.254: R20.2 2.52,45.95 2.52,44.35 4.57,42.29 4.57,41.6 ULN2.8
N$134
  Top 0.254: R19.2 5.03,45.95 5.03,42.98 5.94,42.06 5.94,41.6 ULN2.7
N$135
  Top 0.254: ULN6.18 89.61,25.83 91.21,25.83 95.1,29.72 JP7.1
N$136
  Top 0.254: ULN6.17 89.61,24.46 92.35,24.46 95.1,27.2 JP7.3
N$137
  Top 0.254: ULN6.16 89.61,23.32 93.73,23.32 95.1,24.69 JP7.5
N$138
  Top 0.254: ULN6.15 89.61,21.95 94.87,21.95 95.1,22.17 JP7.7
N$139
  Top 0.254: ULN6.14 89.61,20.34 94.64,20.34 95.1,19.89 JP7.9
N$140
  Top 0.254: ULN6.13 89.61,19.2 93.27,19.2 95.1,17.37 JP7.11
N$141
  Top 0.254: ULN6.12 89.61,17.83 92.13,17.83 95.1,14.86 JP7.13
N$142
  Top 0.254: ULN6.11 89.61,16.69 90.53,16.69 95.1,12.12 JP7.15
N$143
  Top 0.254: ULN7.13 87.33,58.52 87.33,72.24 88.7,73.61 JP5.11
N$144
  Top 0.254: ULN7.12 88.7,58.52 88.7,71.09 91.21,73.61 JP5.13
N$145
  Top 0.254: ULN7.11 89.84,58.52 89.84,69.72 93.73,73.61 JP5.15
N$146
  Top 0.254: ULN5.18 47.55,11.2 47.55,9.14 42.98,4.57 JP6.1
N$147
  Top 0.254: ULN5.17 47.55,12.57 46.86,12.57 44.39,10.1 43.89,8 42.98,7.09 JP6.3
N$148
  Top 0.254: ULN5.16 47.55,13.72 46.86,13.72 42.75,9.6 JP6.5
N$149
  Top 0.254: ULN5.15 47.55,15.09 45.95,15.09 42.98,12.12 JP6.7
N$150
  Top 0.254: ULN5.14 47.55,16.23 44.58,16.23 42.98,14.63 JP6.9
N$159
  Top 0.254: R18.2 7.32,45.95 7.32,41.6 ULN2.6
N$160
  Top 0.254: R17.2 9.83,45.95 9.83,43.43 8.69,42.29 8.69,41.6 ULN2.5
N$161
  Top 0.254: R16.2 12.34,45.95 12.34,44.58 9.83,42.06 9.83,41.6 ULN2.4
N$162
  Top 0.254: R15.2 14.86,45.95 11.2,42.29 11.2,41.6 ULN2.3
N$163
  Top 0.254: ULN5.13 47.05,17.6 42.93,17.6 42.98,17.14 JP6.11
N$164
  Top 0.254: ULN5.12 47.05,19.2 42.7,19.2 42.98,19.43 JP6.13
N$165
  Top 0.254: ULN5.11 47.55,20.34 44.58,20.34 42.98,21.95 JP6.15